# EAGLE design CatchTheLightV2.0 (EAGLE 9.6.2)
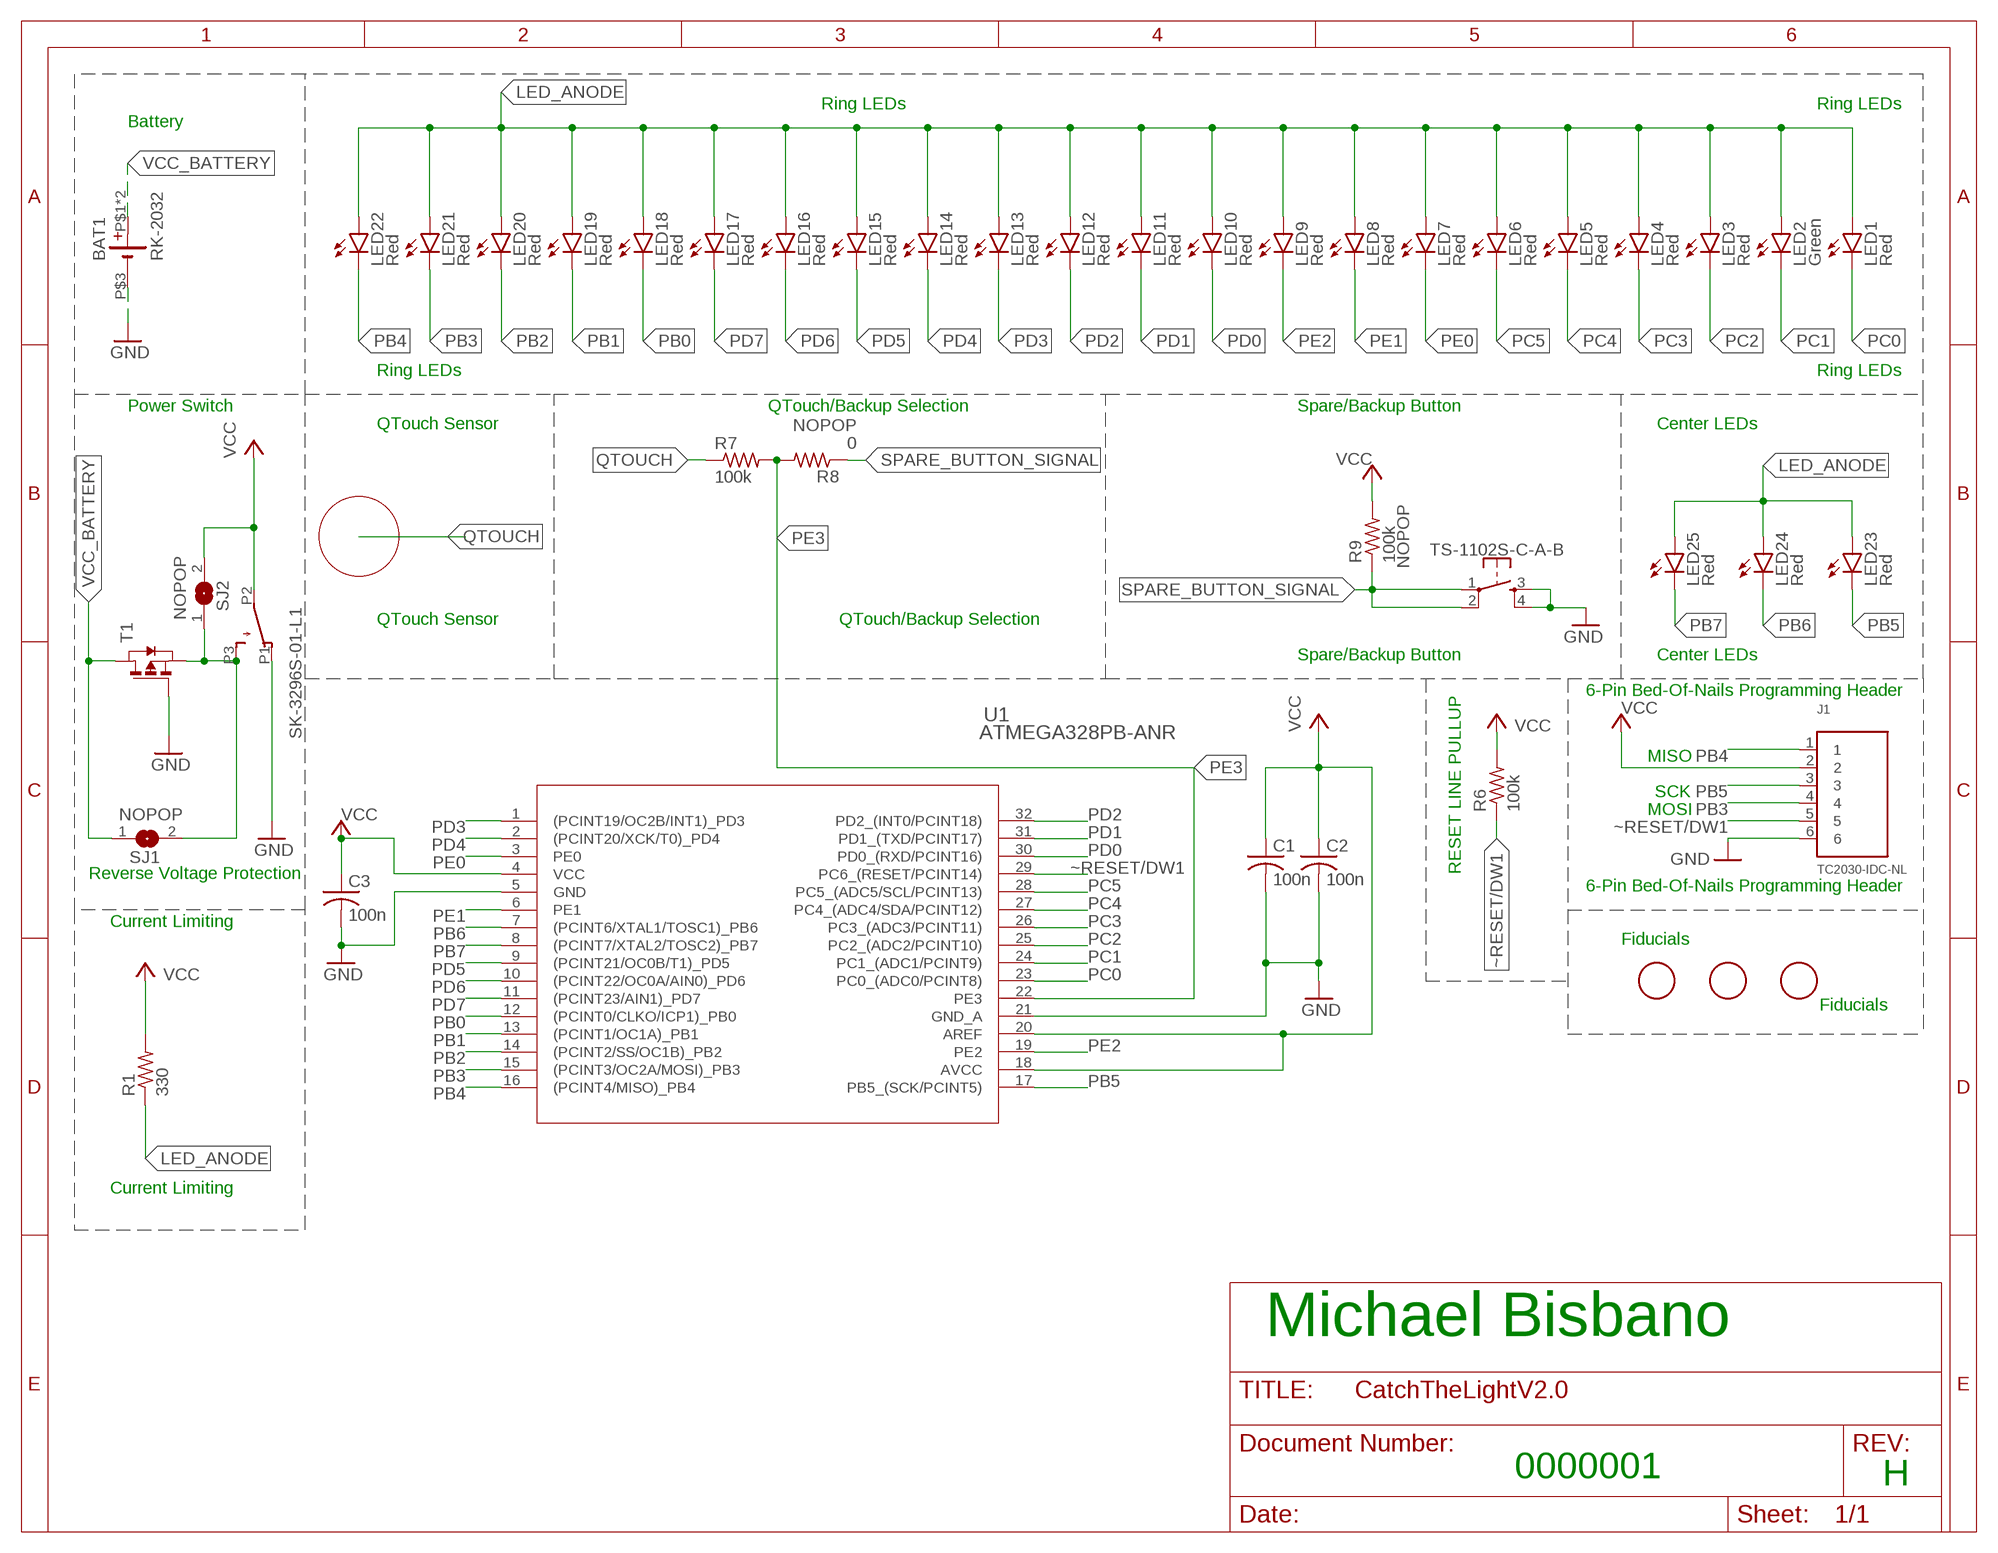
[diagram p0: schematic, sheet 1]

## Parts
BAT1  RK-2032  [RK-2032]
C1  100n  C-US_CHIP-0805(2012-METRIC)  [CAPC2012X110]
C2  100n  C-US_CHIP-0805(2012-METRIC)  [CAPC2012X110]
C3  100n  C-US_CHIP-0805(2012-METRIC)  [CAPC2012X110]
J1  TC2030-IDC-NL  [TAG_TC2030-IDC-NL]
LED1  Red  LEDCHIP-LED0805  [CHIP-LED0805]
LED2  Green  LEDCHIP-LED0805  [CHIP-LED0805]
LED3  Red  LEDCHIP-LED0805  [CHIP-LED0805]
LED4  Red  LEDCHIP-LED0805  [CHIP-LED0805]
LED5  Red  LEDCHIP-LED0805  [CHIP-LED0805]
LED6  Red  LEDCHIP-LED0805  [CHIP-LED0805]
LED7  Red  LEDCHIP-LED0805  [CHIP-LED0805]
LED8  Red  LEDCHIP-LED0805  [CHIP-LED0805]
LED9  Red  LEDCHIP-LED0805  [CHIP-LED0805]
LED10  Red  LEDCHIP-LED0805  [CHIP-LED0805]
LED11  Red  LEDCHIP-LED0805  [CHIP-LED0805]
LED12  Red  LEDCHIP-LED0805  [CHIP-LED0805]
LED13  Red  LEDCHIP-LED0805  [CHIP-LED0805]
LED14  Red  LEDCHIP-LED0805  [CHIP-LED0805]
LED15  Red  LEDCHIP-LED0805  [CHIP-LED0805]
LED16  Red  LEDCHIP-LED0805  [CHIP-LED0805]
LED17  Red  LEDCHIP-LED0805  [CHIP-LED0805]
LED18  Red  LEDCHIP-LED0805  [CHIP-LED0805]
LED19  Red  LEDCHIP-LED0805  [CHIP-LED0805]
LED20  Red  LEDCHIP-LED0805  [CHIP-LED0805]
LED21  Red  LEDCHIP-LED0805  [CHIP-LED0805]
LED22  Red  LEDCHIP-LED0805  [CHIP-LED0805]
LED23  Red  LEDCHIP-LED0805  [CHIP-LED0805]
LED24  Red  LEDCHIP-LED0805  [CHIP-LED0805]
LED25  Red  LEDCHIPLED_0805  [CHIPLED_0805]
PB1  SK-3296S-01-L1  [SK-3296S-01-L1]
PB2  PB2  TS-1102S-C-A-B  [TS-1102S-C-A-B]
R1  330  R-US_R0805  [R0805]
R6  100k  R-US_R0805  [R0805]
R7  100k  R-US_R0805  [R0805]
R8  0  R-US_R0805  [R0805]
R9  100k  R-US_R0805  [R0805]
SJ1  NOPOP  SJW  [SJW]
SJ2  NOPOP  SJW  [SJW]
T1  PMOSSOT23  [SOT-23]
U1  ATMEGA328PB-ANR  [32A_MCH]
U$4  FIDUCIAL  [FIDUCIAL_1MM]
U$5  FIDUCIAL  [FIDUCIAL_1MM]
U$6  FIDUCIAL  [FIDUCIAL_1MM]

## Nets
GND: BAT1.P$3(-) C1.2 C2.2 C3.2 J1.6 PB1.P1 PB2.3 PB2.4 T1.3(G) U1.5(GND) U1.21(GND_A)
LED_ANODE: LED1.A LED2.A LED3.A LED4.A LED5.A LED6.A LED7.A LED8.A LED9.A LED10.A LED11.A LED12.A LED13.A LED14.A LED15.A LED16.A LED17.A LED18.A LED19.A LED20.A LED21.A LED22.A LED23.A LED24.A LED25.A R1.1
PB0: LED18.C U1.12((PCINT0/CLKO/ICP1)_PB0)
PB1: LED19.C U1.13((PCINT1/OC1A)_PB1)
PB2: LED20.C U1.14((PCINT2/SS/OC1B)_PB2)
PB3: J1.4 LED21.C U1.15((PCINT3/OC2A/MOSI)_PB3)
PB4: J1.1 LED22.C U1.16((PCINT4/MISO)_PB4)
PB5: J1.3 LED23.C U1.17(PB5_(SCK/PCINT5))
PB6: LED24.C U1.7((PCINT6/XTAL1/TOSC1)_PB6)
PB7: LED25.C U1.8((PCINT7/XTAL2/TOSC2)_PB7)
PC0: LED1.C U1.23(PC0_(ADC0/PCINT8))
PC1: LED2.C U1.24(PC1_(ADC1/PCINT9))
PC2: LED3.C U1.25(PC2_(ADC2/PCINT10))
PC3: LED4.C U1.26(PC3_(ADC3/PCINT11))
PC4: LED5.C U1.27(PC4_(ADC4/SDA/PCINT12))
PC5: LED6.C U1.28(PC5_(ADC5/SCL/PCINT13))
PD0: LED10.C U1.30(PD0_(RXD/PCINT16))
PD1: LED11.C U1.31(PD1_(TXD/PCINT17))
PD2: LED12.C U1.32(PD2_(INT0/PCINT18))
PD3: LED13.C U1.1((PCINT19/OC2B/INT1)_PD3)
PD4: LED14.C U1.2((PCINT20/XCK/T0)_PD4)
PD5: LED15.C U1.9((PCINT21/OC0B/T1)_PD5)
PD6: LED16.C U1.10((PCINT22/OC0A/AIN0)_PD6)
PD7: LED17.C U1.11((PCINT23/AIN1)_PD7)
PE0: LED7.C U1.3(PE0)
PE1: LED8.C U1.6(PE1)
PE2: LED9.C U1.19(PE2)
PE3: R7.2 R8.2 U1.22(PE3)
PROTECTED_VBAT: PB1.P3 SJ1.2 SJ2.1 T1.2(S)
QTOUCH: R7.1
SPARE_BUTTON_SIGNAL: PB2.1 PB2.2 R8.1 R9.1
VCC: C1.1 C2.1 C3.1 J1.2 PB1.P2 R1.2 R6.2 R9.2 SJ2.2 U1.4(VCC) U1.18(AVCC) U1.20(AREF)
VCC_BATTERY: BAT1.P$1(+) BAT1.P$2(+) SJ1.1 T1.1(D)
~RESET/DW1: J1.5 R6.1 U1.29(PC6_(RESET/PCINT14))

## Notes on the sheet
- Ring LEDs | Ring LEDs
- Battery
- Ring LEDs | Ring LEDs
- Power Switch | QTouch/Backup Selection | Spare/Backup Button
- QTouch Sensor | Center LEDs
- QTouch Sensor | QTouch/Backup Selection
- Spare/Backup Button | Center LEDs
- 6-Pin Bed-Of-Nails Programming Header
- MISO
- SCK
- MOSI
- RESET LINE PULLUP
- Reverse Voltage Protection
- 6-Pin Bed-Of-Nails Programming Header
- Current Limiting
- Fiducials
- Fiducials
- Current Limiting
- Michael Bisbano
- 0000001 | H

## Library data of the parts
BAT1 = ECE_388_CustomParts_V1.1:RK-2032
C1-C3 = Capacitor:C-US: Capacitor - ANSI; CATEGORY: Capacitor
J1 = TC2030-IDC-NL:TC2030-IDC-NL: CABLE ADAPTER 6 POS; AVAILABILITY: Unavailable; DESCRIPTION: 6-PIN PLUG-OF-NAILS CABLE 6; MF: Tag-Connect; MP: TC2030-IDC-NL; PACKAGE: Package; PRICE: None
LED1-LED25 = led:LED: LED OSRAM: - CHIPLED LG R971, LG N971, LY N971, LG Q971, LY Q971, LO R971, LY R971 LH N974, LH R974 LS Q976, LO Q976, LY Q976 LO Q996 - Hyper CHIPLED LW Q18S LB Q993, LB Q99A, LB R99A - SideLED LS A670, LO A670, LY A670, LG A670, LP A670 LB A673, LV A673, LT A673, LW A673 LH A674 LY A675 LS A676, LA A676, LO A676, LY A676, LW A676 LS A679, LY A679, LG A679 - Hyper Micro SIDELED® LS Y876, LA Y876, LO Y876, LY Y876 LT Y87S - SmartLED LW L88C, LW L88S LB L89C, LB L89S, LG L890 LS L89K, LO L89K, LY L89K LS L896, LA L896, LO L896, LY L896 - TOPLED LS T670, LO T670, LY T670, LG T670, LP T670 LSG T670, LSP T670, LSY T670, LOP T670, LYG T670 LG T671, LOG T671, LSG T671 LB T673, LV T673, LT T673, LW T673 LH T674 LS T676, LA T676, LO T676, LY T676, LB T676, LH T676, LSB T676, LW T676 LB T67C, LV T67C, LT T67C, LS T67K, LO T67K, LY T67K, LW E67C LS E67B, LA E67B, LO E67B, LY E67B, LB E67C, LV E67C, LT E67C LW T67C LS T679, LY T679, LG T679 LS T770, LO T770, LY T770, LG T770, LP T770 LB T773, LV T773, LT T773, LW T773 LH T774 LS E675, LA E675, LY E675, LS T675 LS T776, LA T776, LO T776, LY T776, LB T776 LHGB T686 LT T68C, LB T68C - Hyper Mini TOPLED® LB M676 - Mini TOPLED Santana® LG M470 LS M47K, LO M47K, LY M47K Source: http://www.osram.convergy.de LUXEON: - LUMILED® LXK2-PW12-R00, LXK2-PW12-S00, LXK2-PW14-U00, LXK2-PW14-V00 LXK2-PM12-R00, LXK2-PM12-S00, LXK2-PM14-U00 LXK2-PE12-Q00, LXK2-PE12-R00, LXK2-PE12-S00, LXK2-PE14-T00, LXK2-PE14-U00 LXK2-PB12-K00, LXK2-PB12-L00, LXK2-PB12-M00, LXK2-PB14-N00, LXK2-PB14-P00, LXK2-PB14-Q00 LXK2-PR12-L00, LXK2-PR12-M00, LXK2-PR14-Q00, LXK2-PR14-R00 LXK2-PD12-Q00, LXK2-PD12-R00, LXK2-PD12-S00 LXK2-PH12-R00, LXK2-PH12-S00 LXK2-PL12-P00, LXK2-PL12-Q00, LXK2-PL12-R00 Source: www.luxeon.com KINGBRIGHT: KA-3528ASYC Source: www.kingbright.com
PB1 = ECE_388_CustomParts_V1.1:SK-3296S-01-L1
PB2 = ECE_388_CustomParts_V1.1:TS-1102S-C-A-B
R1 R6 R7 = rcl:R-US_: RESISTOR, American symbol; SPICEPREFIX: R
R8 R9 = rcl:R-US_: RESISTOR, American symbol; NOPOP: NOPOP; SPICEPREFIX: R
SJ1 SJ2 = ECE388:SJ: SMD solder JUMPER
T1 = zetex:PMOSSOT23: MOS FET; OC_FARNELL: unknown; OC_NEWARK: unknown
U1 = ECE_388_CustomParts_V1.1:ATMEGA328PB-ANR; BUILT_BY: EMA_Molly; COPYRIGHT: Copyright (C) 2018 Accelerated Designs. All rights reserved; MANUFACTURER_PART_NUMBER: ATMEGA328PB-ANR; SOURCELIBRARY: Microchip_2019-09-03; VENDOR: Microchip
U$4-U$6 = ECE388:FIDUCIAL: For use by pick and place machines to calibrate the vision/machine, 1mm By microbuilder.eu

## Board
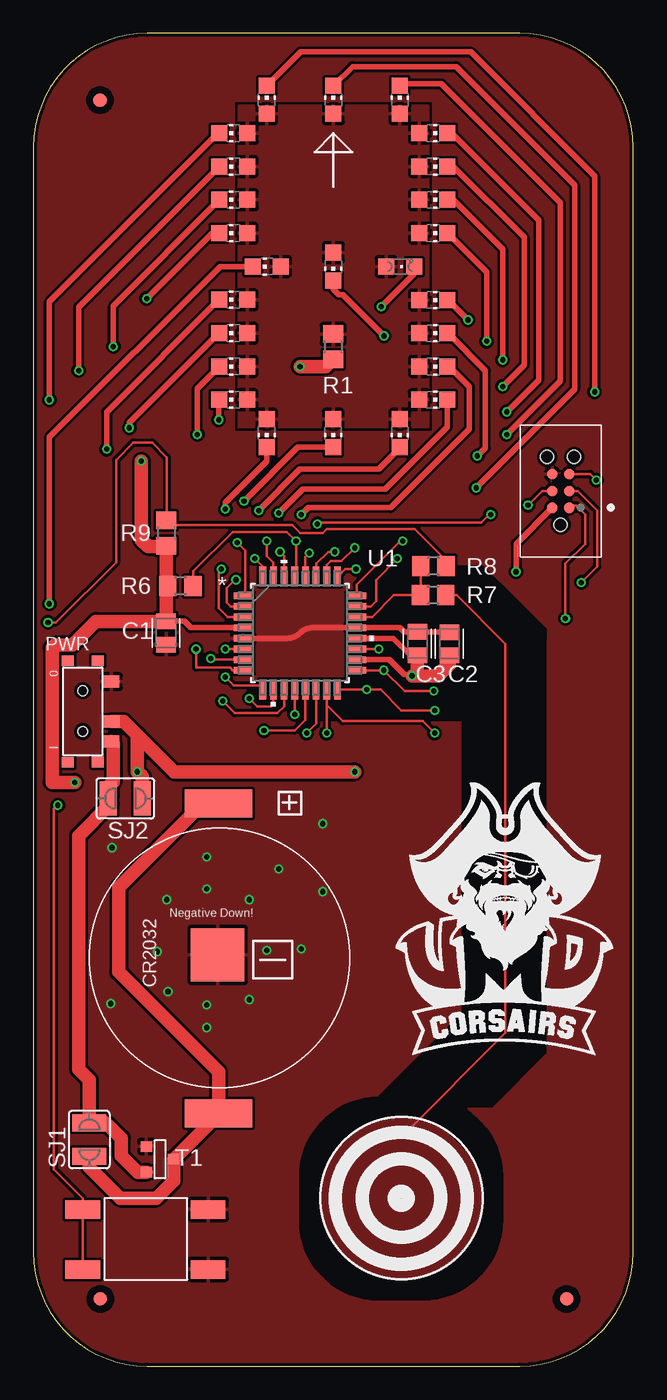
[diagram p1: board, top side]
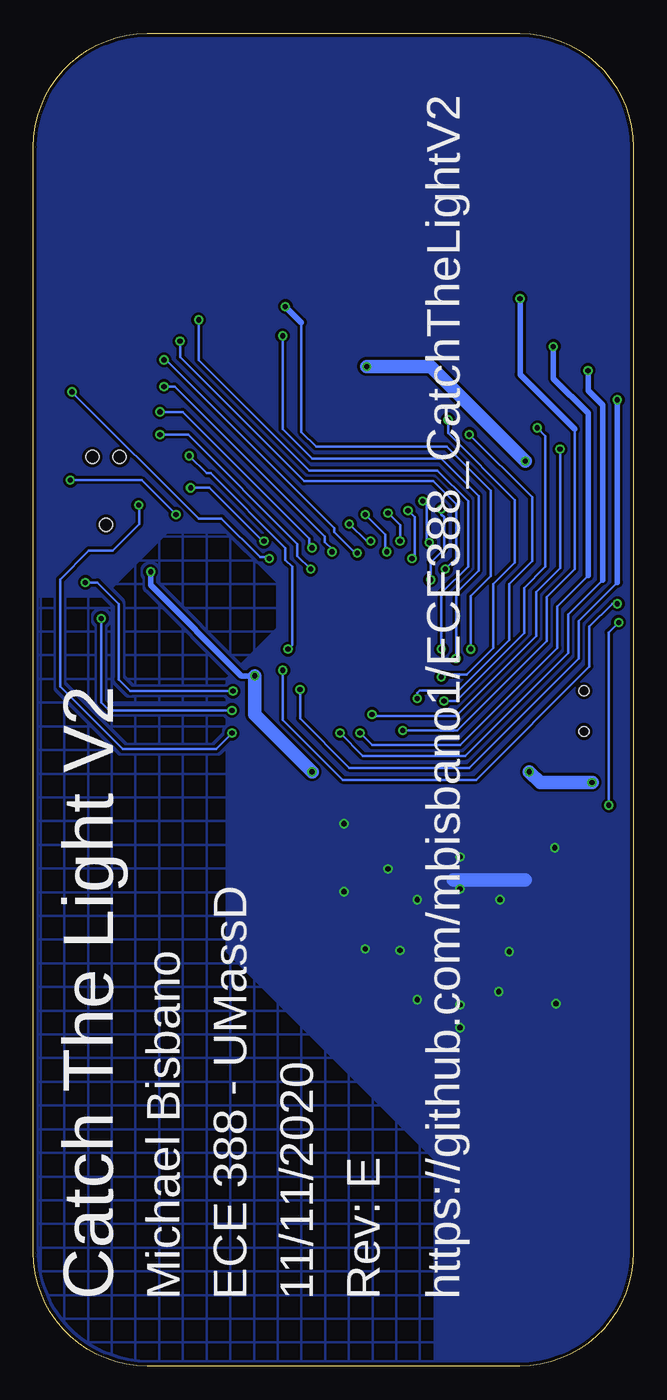
[diagram p2: board, bottom side, seen from below]

Size 45 x 100 mm. Coordinates in mm from the lower left corner, seen from the top.
Outline: 0,91.46 0,8.54 arc90 8.54,0 36.46,0 arc90 45,8.54 45,91.46 arc90 36.46,100 8.54,100 arc90 0,91.46
Copper layers (1*16): Top 0.035mm / dielectric 1.5mm / Bottom 0.035mm
Design rules "Dirty8TS": minimum track width 8mil, minimum drill 15mil, track to track 8mil, track to pad 8mil, pad to pad 8mil, via to via 8mil, smd to smd 0mil, copper to edge 10mil, drill to drill 10mil, minimum pad ring 10mil, minimum via ring 6mil, stop-mask expansion 2mil, vias tented up to drill 25mil, thermal gap 10mil

### Footprints (pad centres in the part's own frame; a part is rotated, then mirrored left to right if it is on the bottom)
RK-2032 = smd 2.1 x 5.05: P$1 22.21,3.53; P$2 -1.04,3.53 | smd 4 x 4: P$3 10.85,3.6
CAPC2012X110 = smd 1.165 x 1.465: 1 -0.875,0; 2 0.875,0
TAG_TC2030-IDC-NL = smd 0.787 x 0.787: 1 -1.27,-0.635; 2 -1.27,0.635; 3 0,-0.635; 4 0,0.635; 5 1.27,-0.635; 6 1.27,0.635 | hole 0.991: -2.54,0; 2.54,1.016; 2.54,-1.016
CHIP-LED0805 = smd 1.2 x 1.2: A 0,-1.05; C 0,1.05
CHIPLED_0805 = smd 1.2 x 1.2: A 0,-1.05; C 0,1.05
SK-3296S-01-L1 = smd 0.8 x 0.9: MOUNT0 -0.4,-0.412; MOUNT1 -0.398,-2.678; MOUNT2 7.2,-2.678; MOUNT3 7.185,-0.425 | smd 0.9 x 1.2: P1 1.155,0.603; P2 4.155,0.615; P3 5.655,0.603 | hole 0.75: 1.85,-1.55; 4.9,-1.55
TS-1102S-C-A-B = smd 2.6 x 1.4: 1 1.3,-0.7; 2 1.3,-5.2; 3 10.7,-0.7; 4 10.7,-5.2
R0805 = smd 1.3 x 1.5: 1 -0.95,0; 2 0.95,0
SJW = smd 1.27 x 2.54: 1 -1.27,0; 2 1.27,0
SOT-23 = smd 0.787 x 0.889: 1 0.025,-1.016; 2 -0.94,1.016; 3 0.991,1.016
32A_MCH = smd 1.461 x 0.501: 1 -4.25,2.8; 2 -4.25,2; 3 -4.25,1.2; 4 -4.25,0.4; 5 -4.25,-0.4; 6 -4.25,-1.2; 7 -4.25,-2; 8 -4.25,-2.8; 17 4.25,-2.8; 18 4.25,-2; 19 4.25,-1.2; 20 4.25,-0.4; 21 4.25,0.4; 22 4.25,1.2; 23 4.25,2; 24 4.25,2.8 | smd 0.501 x 1.461: 9 -2.8,-4.25; 10 -2,-4.25; 11 -1.2,-4.25; 12 -0.4,-4.25; 13 0.4,-4.25; 14 1.2,-4.25; 15 2,-4.25; 16 2.8,-4.25; 25 2.8,4.25; 26 2,4.25; 27 1.2,4.25; 28 0.4,4.25; 29 -0.4,4.25; 30 -1.2,4.25; 31 -2,4.25; 32 -2.8,4.25
FIDUCIAL_1MM = smd 1 x 1: 1 0,0

### Placement (x,y rotation side)
BAT1  17.42,20.01 90 top
C1  9.95,55.01 270 top
C2  31.2,54.2 90 top
C3  28.8,54.22 90 top
J1  39.55,65.67 90 top
LED1  17.49,95.01 0 top
LED2  22.51,95.01 0 top
LED3  27.49,95.01 0 top
LED4  30.01,92.51 270 top
LED5  30.01,90.01 270 top
LED6  30.01,87.51 270 top
LED7  30.01,85.01 270 top
LED8  30,80 270 top
LED9  30,77.5 270 top
LED10  30,75 270 top
LED11  29.99,72.51 270 top
LED12  27.5,70 180 top
LED13  22.48,70 180 top
LED14  17.5,70 180 top
LED15  14.99,72.5 90 top
LED16  14.99,75 90 top
LED17  14.99,77.5 90 top
LED18  14.99,80 90 top
LED19  14.99,85 90 top
LED20  15.01,87.5 90 top
LED21  14.99,90 90 top
LED22  15,92.5 90 top
LED23  17.5,82.5 90 top
LED24  22.51,82.51 180 top
LED25  27.5,82.5 270 top
PB1  5.25,52.52 270 top
PB2  2.4,12.46 0 top
R1  22.48,76.49 270 top
R6  11.03,58.54 180 top
R7  29.98,57.84 180 top
R8  30.01,60.02 180 top
R9  9.98,62.51 270 top
SJ1  4.2,17 90 top
SJ2  6.9,42.6 0 top
T1  9.5,15.5 90 top
U1  20,55.01 0 top
U$4  5.03,5.04 0 top
U$5  39.99,5.04 0 top
U$6  5,94.99 0 top

### Tracks (layer width: path | path; a pad name or v marks a point on that pad's centre or on a via)
GND  (via drill 0.38)
  Top 0.406: U1.5 19.06,54.61 arc45 20,55 arc-45 20.99,55.41 U1.21 27.49,55.41 27.81,55.09 C3.2 31.18,55.09 C2.2
  Bottom 1.016: 8.1,36.5 13.5,36.5
  other vias: 9.3,31.1 10,35 13,35.8 16.2,35 17.5,31.2 16.2,27.5 13,27.1 10.1,28.1 20.1,31.3 13,25.4 13,38.2 18.4,37.3 5.9,38.9 5.8,27.2 21.7,40.7 21.7,35.6
  pour Bottom: 2.2,-2.5 14.9,-2.5 14.9,15.5 30.5,31.1 30.5,51.6 26.7,55.4 26.7,58.8 30.4,62.5 35,62.5 39.8,57.7 45.4,57.7 58.4,70.7 58.4,99.7 49.1,109 -13.6,109 -13.6,13.3
  pour Bottom (rank 2, no thermals, hatched): 10.8,-1.1 10.8,62.9 45.6,62.9 45.6,-1.1
  pour Top (isolate 1.676, rank 4): -3.7,106.1 51.5,106.1 52.7,104.9 52.7,-4 41.7,-15 -7.6,-15 -18.1,-4.5 -18.1,91.7
  pour Top (rank 3): -2.7,48.3 34.1,48.3 23.3,37.5 23.3,22.3 16.99,15.99 16.8,2.56 32.06,2.56 38.6,7.77 38.6,55.3 31.5,62.4 29.1,62.4 15.7,49 0,49 0,101.67 38.6,101.2 53.7,101.2 53.7,-2.5 -2.7,-2.5
  pour Top (rank 3): 0,2.6 17.1,2.6 17.6,2.1 32.5,2.1 39.8,9.4 42.3,9.4 42.3,55.2 36.1,61.4 24,61.4 24,58.2 23.9,58.1 23.2,58.1 23.2,51.4 31.6,51.4 32.1,50.9 32.1,47.4 -1.3,47.4 -1.3,61.4 -3,63.1 -3,106.4 57.3,106.4 57.7,106 57.7,3.5 52.8,-1.4 1.4,-1.4 0,0
  cutout Top (rank 6): 32.2,54.8 32.2,26.5 25.2,19.5 34.4,19.5 38.4,23.5 38.4,54.8
  pour Top (rank 2): -5,102.7 -5,52.6 19.1,52.6 23.5,57 25.4,57 27.3,58.9 27.3,60.9 27.6,61.2 30,61.2 30.3,60.9 30.3,60.2 35.2,60.2 37,58.4 46.1,58.4 47.5,59.8 47.5,100 45.8,101.7 -2.3,101.7 -3.3,102.7
LED_ANODE
  pour Top: 15.4,94.6 29.6,94.6 29.6,70.4 15.4,70.4
PB0  (via drill 0.38)
  Top 0.203: U1.12 v19.6,48.9
  Top 0.406: LED18.C 13.9,80 5.5,71.6 v5.5,68.8
  Bottom 0.203: v19.6,48.9 19.5,48.8 13.3,48.8 7.3,54.8 7.3,58.1 5.5,59.9 v5.5,68.8
PB1  (via drill 0.38)
  Top 0.203: U1.13 20.4,48.49 19.6,47.69 v17.3,47.69
  Top 0.406: LED19.C 13.4,85 v8.5,80.1
  Bottom 0.203: v17.3,47.69 13.21,47.69 6.5,54.4 6.5,57.7 4.4,59.8 4.4,70.3
  Bottom 0.406: v8.5,80.1 8.5,74.4 4.4,70.3
PB2  (via drill 0.38)
  Top 0.203: U1.14 21.2,48.2 v20.5,47.5
  Top 0.406: v6,76.5 6,79.55 LED20.C
  Bottom 0.203: v20.5,47.5 19.6,46.6 13,46.6 5.7,53.9 5.7,57 3.4,59.3
  Bottom 0.406: 3.4,59.3 3.4,71.5 6,74.1 v6,76.5
PB3  (via drill 0.38)
  Top 0.203: v30.1,47.5 29.2,48.4 23.2,48.4 22,49.6 U1.15 v22,47.5 | v37.1,64.6 38.17,65.67 J1.4
  Top 0.406: v3.4,74.7 3.4,79.46 LED21.C
  Bottom 0.203: v22,47.5 20.3,45.8 12.6,45.8 4.9,53.5 4.9,56.4 2.3,59 | v37.1,64.6 37.06,64.56 37.06,63.17 39.03,61.2 40.83,61.2 43,59.03 43,51 38.3,46.3 31.3,46.3 v30.1,47.5
  Bottom 0.406: 2.3,59 2.3,72.1 3.4,73.2 v3.4,74.7
PB4  (via drill 0.38)
  Top 0.203: U1.16 v25,50.76 26.04,50.76 27.6,49.2 v30.1,49.2 | v39.91,56.1 39.91,60.21 41.4,61.7 41.4,63.9 40.73,64.57 40.35,64.57 J1.1
  Top 0.406: v1.2,72.5 1.2,79.86 13.85,92.5 LED22.C
  Bottom 0.203: v25,50.76 25,48.6 21.3,44.9 12.3,44.9 4.1,53.1 4.1,55.9 1.2,58.8 | v30.1,49.2 39.3,49.2 39.91,49.81 v39.91,56.1
  Bottom 0.406: 1.2,58.8 v1.2,72.5
PB5  (via drill 0.38)
  Top 0.203: U1.17 v26.29,52.21 27.85,50.65 v30.02,50.65 | v41.1,58.8 42.3,60 42.3,64.2 40.83,65.67 J1.3
  Top 0.406: v1.2,57.2 1.2,69.7 14,82.5 LED23.C
  Bottom 0.203: v26.29,52.21 26.29,48.49 21.8,44 11.8,44 3.3,52.5 3.3,55.5 1.6,57.2 v1.2,57.2 | v30.02,50.65 37.73,50.65 38.6,51.52 38.6,57.2 40.2,58.8 v41.1,58.8
PB6  (via drill 0.38)
  Top 0.203: U1.7 13.39,53.01 v13.3,53.1
  Top 0.406: v26.3,77.3 23.2,80.4 22.9,80.4 22.51,80.79 LED24.C
  Bottom 0.203: v13.3,53.1 13.3,58 11.6,59.7 11.6,65.3 14.4,68.1 24.1,68.1 26.3,70.3 v26.3,77.3
PB7  (via drill 0.38)
  Top 0.203: U1.8 14.95,52.21 14.75,52.41 12.2,52.41 v12.2,53.79
  Top 0.406: LED25.C 28.55,81.95 v26.1,79.5
  Bottom 0.203: v12.2,53.79 12.2,57.8 10.7,59.3 10.7,65.7 14,69 23.8,69 24.9,70.1 24.9,78.3
  Bottom 0.406: v26.1,79.5 24.9,78.3
PC0  (via drill 0.38)
  Top 0.203: U1.23 25.31,57.01 25.7,57.4 25.7,59 v27.3,60.6
  Top 0.406: LED1.C 20.04,98.61 32.79,98.61 42.1,89.3 v42.1,73.1
  Bottom 0.203: v42.1,73.1 32.6,63.6 30.9,63.6 28,60.7 27.5,60.7 27.4,60.6 v27.3,60.6
PC1  (via drill 0.38)
  Top 0.203: v27.7,61.9 27.5,61.9 24.25,58.65 U1.24
  Top 0.406: LED2.C 23.95,97.5 31.7,97.5 40.6,88.6 40.6,73.29 v33.21,65.9
  Bottom 0.203: v33.21,65.9 31.81,65.9 27.81,61.9 v27.7,61.9
PC2  (via drill 0.38)
  Top 0.203: U1.25 22.86,59.26 23.4,59.8 v24.2,59.8
  Top 0.406: LED3.C 27.49,96.2 30.6,96.2 39.5,87.3 39.5,73.9 v35.5,69.9
  Bottom 0.203: v24.2,59.8 25.2,60.8 25.2,61.7 33.4,69.9 v35.5,69.9
PC3  (via drill 0.38)
  Top 0.203: v24.1,61.4 23.1,60.4 22.3,60.4 22,60.1 U1.26
  Top 0.406: LED4.C 31.39,92.51 37.9,86 37.9,74 v35.5,71.6
  Bottom 0.203: v35.5,71.6 33.8,71.6 24.3,62.1 24.3,61.6 v24.1,61.4
PC4  (via drill 0.38)
  Top 0.203: v22.6,61.1 22.1,61.1 21.2,60.2 U1.27
  Top 0.406: LED5.C 31.49,90.01 36.8,84.7 36.8,75.1 v35.2,73.5
  Bottom 0.203: v35.2,73.5 34.4,73.5 23.15,62.25 23.15,61.85 22.6,61.3 v22.6,61.1
PC5  (via drill 0.38)
  Top 0.203: v20.7,61 20.4,60.7 U1.28
  Top 0.406: LED6.C 31.49,87.51 35.2,83.8 v35.2,75.5
  Bottom 0.203: v35.2,75.5 35.04,75.5 22.42,62.88 22.42,62.58 20.84,61 v20.7,61
PD0  (via drill 0.38)
  Top 0.203: v18.5,61.1 18.8,60.8 U1.30
  Top 0.406: LED10.C 31.2,75 32.7,73.5 32.7,70.3 26.8,64.4 20.6,64.4 v20.1,63.9
  Bottom 0.203: v20.1,63.9 18.6,62.4 18.6,61.2 v18.5,61.1
PD1  (via drill 0.38)
  Top 0.203: U1.31 18,60.3 17.5,60.8 v17.5,61.9
  Top 0.406: LED11.C 31.04,70.44 26.4,65.8 20.2,65.8 v18.4,64
  Bottom 0.203: v17.5,61.9 17.5,63.1 v18.4,64
PD2  (via drill 0.38)
  Top 0.203: LED12.C 27.5,68.89 | v16.6,60.6 17.2,60 U1.32
  Top 0.406: v16.9,64.21 20,67.31 25.91,67.31 27.5,68.89
  Bottom 0.203: v16.9,64.21 v16.9,64.2 16.4,63.7 16.4,60.8 v16.6,60.6
PD3  (via drill 0.38)
  Top 0.203: v15.3,61.8 15.9,61.2 15.9,57.96 U1.1
  Top 0.406: LED13.C 19.84,68.94 v15.8,64.9
  Bottom 0.203: v15.8,64.9 15.5,64.6 15.5,62 v15.3,61.8
PD4  (via drill 0.38)
  Top 0.203: U1.2 14.79,57.01 14.5,57.3 14.5,58.4 15.1,59 v15.2,59
  Top 0.406: LED14.C 17.5,67.9 14.4,64.8 v14.4,64.3
  Bottom 0.203: v14.4,64.3 14.4,63.9 14.2,63.7 14.2,61.3 15.2,60.3 v15.2,59
PD5  (via drill 0.38)
  Top 0.203: U1.9 16.9,51.06 15.04,51.06 v14.4,51.7 | 13.9,72.46 LED15.C
  Top 0.406: v13.9,71 13.9,72.46
  Bottom 0.203: v14.4,51.7 14.2,51.9 12.5,51.9 10.5,53.9 10.5,58.7 8.9,60.3 8.9,65 13.9,70 v13.9,71
PD6  (via drill 0.38)
  Top 0.203: U1.10 18,49.7 17.8,49.5 16.8,49.5 v16.2,50.1
  Top 0.406: v12.3,69.9 12.3,73.36 LED16.C
  Bottom 0.203: v16.2,50.1 16.2,50.5 16.01,50.69 13.11,50.69 9.3,54.5 9.3,58.7 7.6,60.4 7.6,65.2 v12.3,69.9
PD7  (via drill 0.38)
  Top 0.203: U1.11 18.8,49.5 18.3,49 15.1,49 v14.2,49.9
  Top 0.406: LED17.C 13.9,77.5 7.2,70.8 v7.2,70.4
  Bottom 0.203: v14.2,49.9 13.3,49.9 8.2,55 8.2,58.4 6.6,60 6.6,69.8 v7.2,70.4
PE0  (via drill 0.38)
  Top 0.203: U1.3 14.59,56.21 13.9,56.9 13.9,59.6 v14.1,59.8
  Top 0.406: v34,76.9 34,82.1 31.09,85.01 LED7.C
  Bottom 0.203: v14.1,59.8 13.3,60.6 13.3,64.7 15,66.4 24.7,66.4 34,75.7 v34,76.9
PE1  (via drill 0.38)
  Top 0.203: U1.6 v14.4,53.8
  Top 0.406: v32.6,78.5 31.1,80 LED8.C
  Bottom 0.203: v32.6,78.5 32.6,75.5 24.3,67.2 14.7,67.2 12.4,64.9 12.4,60 14.4,58 v14.4,53.8
PE2  (via drill 0.38)
  Top 0.203: U1.19 v25.89,53.81 v25.9,53.8
  Top 0.406: LED9.C 31.1,77.5 33.9,74.7 33.9,68.89 v33.3,68.3
  Bottom 0.203: v33.3,68.3 32,67 31.7,67 26.1,61.4 26.1,60.5 25.6,60 25.6,54.1 v25.9,53.8
PE3
  Top 0.203: U1.22 25.4,56.21 27.03,57.84 R7.2 29.06,57.87 R8.2
PROTECTED_VBAT
  Top 1.016: 5.79,42.76 5.79,42.19 3.4,39.8 3.4,22.27 4.2,21.47 SJ1.2 5.43,18.27 6.6,17.1 6.6,15.8 7.84,14.56 T1.2 | 5.79,42.76 5.79,43.64 5.99,43.84 5.99,46.73 PB1.P3 | SJ2.1 5.79,42.76
QTOUCH
  Top 0.203: R7.1 31.76,57.84 35.4,54.2 35.4,25 27.8,17.4 27.6,17.4
  pour Top (isolate 3.9, no thermals): 27.6,18.5 arc90 21.65,12.55 arc90 27.55,6.65 arc90 33.5,12.6 arc90
SPARE_BUTTON_SIGNAL  (via drill 0.38)
  Top 0.203: PB2.2 PB2.1 3.7,12.6 1.54,14.76 1.54,41.79 v1.84,42.09 | R8.1 30.96,60.44 28.6,62.8 22.01,62.8 21.71,62.5 20,62.5 19.4,63.1 10.02,63.1 10.02,63.5 | 10.02,63.5 R9.1 | 10.02,63.5 10.02,68.18 8.9,69.3 7.5,69.3 6.2,68 6.2,60.3 1.7,55.8 v1.1,55.8
  Bottom 0.203: v1.1,55.8 1.85,55.05 v1.85,42.1 v1.84,42.09
VCC  (via drill 0.38)
  Top 0.406: C2.1 31.2,53.1 30,51.9 28.8,51.9 27.8,51.9 26.69,53.01 U1.18 | U1.20 26.99,54.61 28.26,53.34 C3.1 | U1.4 11.79,55.41 11.3,55.9 9.96,55.9 C1.1 | v36.2,59.6 36.2,61.69 J1.2
  Top 1.016: v20,75 21.94,75 R1.2 | v8.1,67.9 8.1,62 8.6,61.5 9.92,61.5 R9.2 9.98,58.44 | C2.1 31.2,52.62 30.38,51.8 v28.4,51.8 | 7.8,47.36 10.56,44.6 v24.1,44.6 | v3.1,43.8 1.4,43.8 1.4,53.9 1.6,54.1 2.9,54.1 4.68,55.88 C1.1 9.95,58.41 9.98,58.44 | 7.8,47.36 v7.8,44.6 8.17,44.23 SJ2.2 | 7.8,47.36 6.8,48.37 PB1.P2 | 9.98,58.44 R6.2 | C3.1 28.8,51.9
  Bottom 0.406: v28.4,51.8 29.4,51.8 36.2,58.6 v36.2,59.6
  Bottom 1.016: v20,75 15.2,75 v8.1,67.9 | v28.4,51.8 28.4,48.9 v24.1,44.6 | v7.8,44.6 7,43.8 v3.1,43.8
VCC_BATTERY
  Top 1.016: BAT1.P$1 12.69,42.22 6.39,35.92 6.39,29.57 13.89,22.07 BAT1.P$2 13.89,18.9 T1.1 10.52,13.92 9.2,12.6 6.53,12.6 4.2,14.93 SJ1.1
~RESET/DW1  (via drill 0.38)
  Top 0.203: U1.29 19.7,59.36 v19.7,61.9 19,62.6 14.94,62.6 11.98,59.64 R6.1 | v42.22,66.48 42.22,66.5 41.78,66.94 J1.5 | v21.3,63.19 21.3,63.3 33.6,63.3 34.2,63.9 v34.3,63.9
  Bottom 0.203: v19.7,61.9 20.01,61.9 v21.3,63.19 | v34.3,63.9 36.88,66.48 v42.22,66.48

### Text on the board
tPlace: PWR | CR2032 | Negative Down!
bPlace: https://github.com/mbisbano1/ECE388_CatchTheLightV2 | Rev: E | 11/11/2020 | ECE 388 - UMassD | Michael Bisbano | Catch The Light V2